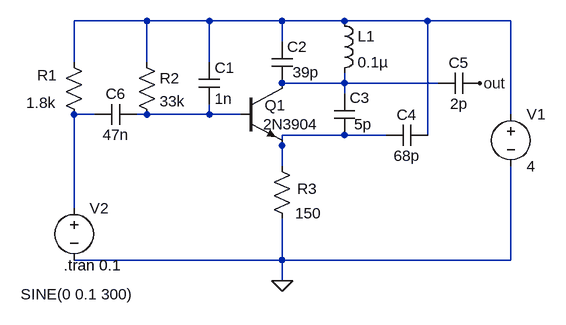
[diagram p0: schematic Draft1.asc]
Draft1.asc, the LTspice schematic file:
Version 4
SHEET 1 880 680
WIRE 240 32 128 32
WIRE 336 32 240 32
WIRE 448 32 336 32
WIRE 544 32 448 32
WIRE 672 32 544 32
WIRE 800 32 672 32
WIRE 448 64 448 32
WIRE 128 96 128 32
WIRE 240 96 240 32
WIRE 336 96 336 32
WIRE 544 128 544 112
WIRE 544 128 448 128
WIRE 688 128 544 128
WIRE 544 144 544 128
WIRE 160 176 128 176
WIRE 240 176 224 176
WIRE 336 176 336 160
WIRE 336 176 240 176
WIRE 384 176 336 176
WIRE 800 176 800 32
WIRE 544 208 448 208
WIRE 608 208 544 208
WIRE 672 208 672 32
WIRE 448 224 448 208
WIRE 448 256 448 224
WIRE 128 320 128 176
WIRE 448 400 448 336
WIRE 448 400 128 400
WIRE 800 400 800 256
WIRE 800 400 448 400
WIRE 448 432 448 400
FLAG 448 432 0
FLAG 752 128 out
SYMBOL res 112 80 R0
WINDOW 0 -41 36 Left 2
WINDOW 3 -58 78 Left 2
SYMATTR InstName R1
SYMATTR Value 1.8k
SYMBOL res 224 80 R0
SYMATTR InstName R2
SYMATTR Value 33k
SYMBOL cap 320 96 R0
SYMATTR InstName C1
SYMATTR Value 1n
SYMBOL cap 432 64 R0
WINDOW 3 32 47 Left 2
SYMATTR Value 39p
SYMATTR InstName C2
SYMBOL res 432 240 R0
WINDOW 0 39 50 Left 2
WINDOW 3 36 88 Left 2
SYMATTR InstName R3
SYMATTR Value 150
SYMBOL cap 528 144 R0
WINDOW 0 24 6 Left 2
WINDOW 3 31 47 Left 2
SYMATTR InstName C3
SYMATTR Value 5p
SYMBOL ind 528 16 R0
SYMATTR InstName L1
SYMATTR Value 0.1µ
SYMBOL cap 672 192 R90
WINDOW 0 0 32 VBottom 2
WINDOW 3 32 32 VTop 2
SYMATTR InstName C4
SYMATTR Value 68p
SYMBOL cap 752 112 R90
WINDOW 0 0 32 VBottom 2
WINDOW 3 32 32 VTop 2
SYMATTR InstName C5
SYMATTR Value 2p
SYMBOL cap 224 160 R90
WINDOW 0 0 32 VBottom 2
WINDOW 3 32 32 VTop 2
SYMATTR InstName C6
SYMATTR Value 47n
SYMBOL npn 384 128 R0
WINDOW 0 37 34 Left 2
WINDOW 3 35 63 Left 2
SYMATTR InstName Q1
SYMATTR Value 2N3904
SYMBOL voltage 800 160 R0
WINDOW 123 0 0 Left 0
WINDOW 39 0 0 Left 0
SYMATTR InstName V1
SYMATTR Value 4
SYMBOL voltage 128 304 R0
WINDOW 123 0 0 Left 0
WINDOW 39 0 0 Left 0
WINDOW 3 -82 149 Left 2
SYMATTR Value SINE(0 0.1 300)
SYMATTR InstName V2
TEXT 112 408 Left 2 !.tran 0.1

The netlist it stands for:
* Draft1.asc
R1 N001 N003 1.8k
R2 N001 N004 33k
C1 N001 N004 1n
C2 N001 N002 39p
R3 N005 0 150
C3 N002 N005 5p
L1 N001 N002 0.1µ
C4 N001 N005 68p
C5 out N002 2p
C6 N004 N003 47n
Q1 N002 N004 N005 0 2N3904
V1 N001 0 4
V2 N003 0 SINE(0 0.1 300)
.model NPN NPN
.model PNP PNP
.lib standard.bjt
.tran 0.1
.backanno
.end